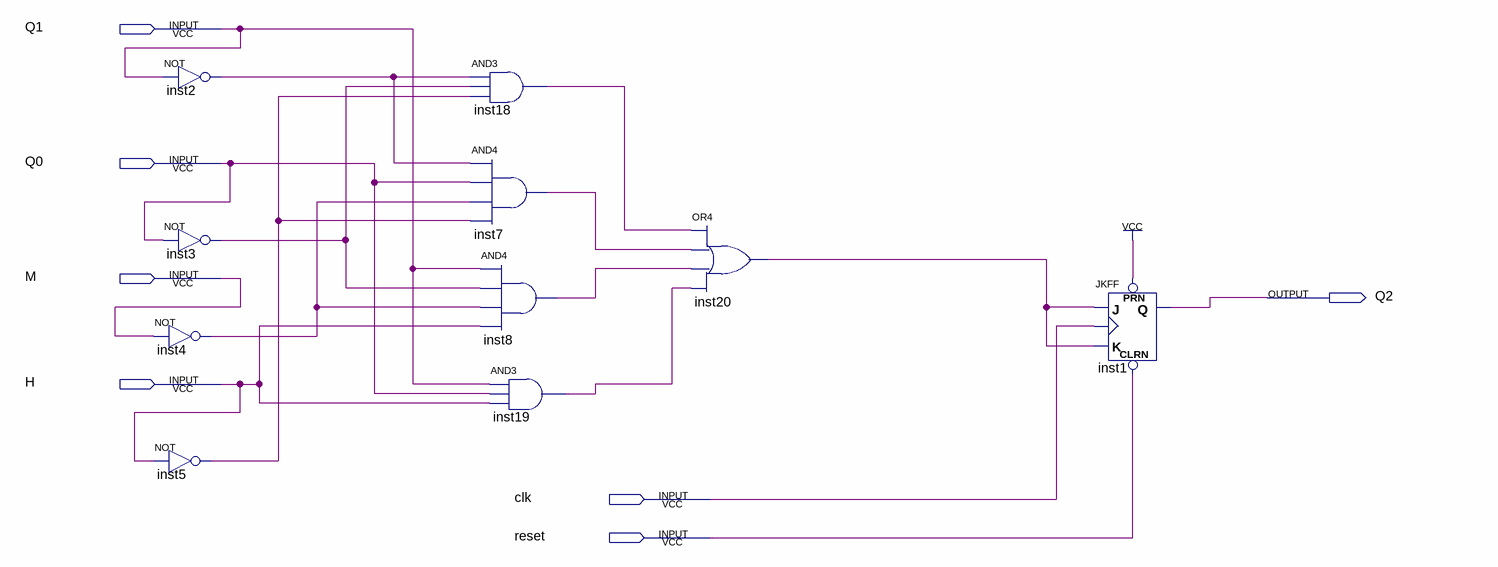
[diagram p0: schematic sheet]
// Quartus schematic FLIPFLOPJK2.bdf as structural Verilog: 10 symbols, 7 pins
module FLIPFLOPJK2 (
  input  Q1,
  input  Q0,
  input  M,
  input  H,
  input  clk,
  input  reset,
  output Q2
);

  wire inst2_out, inst3_out, inst4_out, inst5_out, inst7_out, inst8_out, inst18_out, inst19_out, inst20_out;

  not inst2 (inst2_out, Q1);
  not inst3 (inst3_out, Q0);
  not inst4 (inst4_out, M);
  not inst5 (inst5_out, H);
  and inst18 (inst18_out, inst2_out, inst3_out, inst5_out);
  and inst7 (inst7_out, inst2_out, Q0, inst4_out, inst5_out);
  and inst8 (inst8_out, Q1, inst3_out, inst4_out, H);
  and inst19 (inst19_out, Q1, Q0, H);
  or inst20 (inst20_out, inst18_out, inst7_out, inst8_out, inst19_out);
  JKFF inst1 (.PRN(1'b1), .CLRN(reset), .K(inst20_out), .J(inst20_out), .CLK(clk), .Q(Q2));
endmodule
